# EAGLE design Particle Feather AdapterFeb2019v1 (EAGLE 9.3.0)
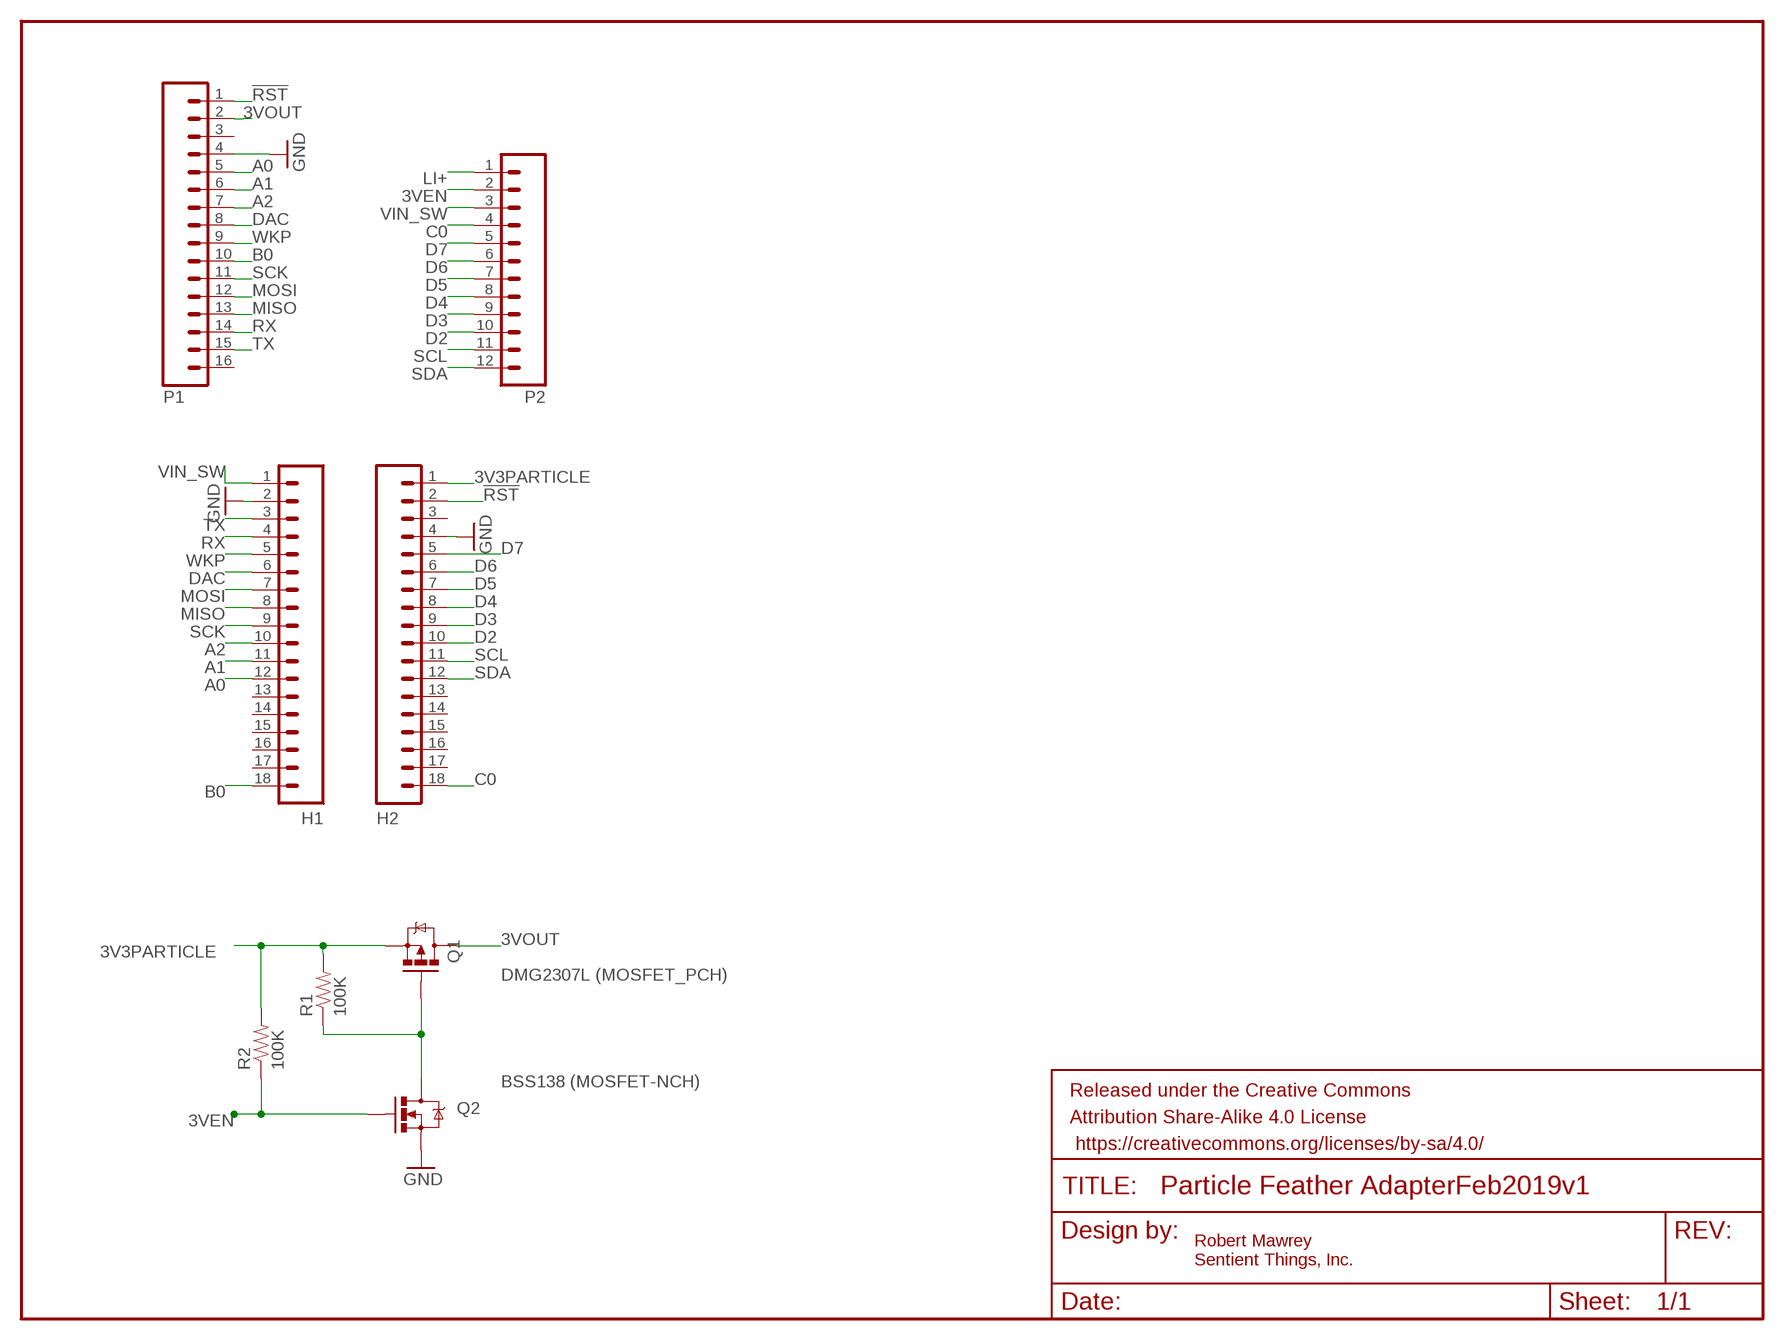
[diagram p0: schematic, sheet 1]

## Parts
FRAME1  FRAME-LETTER  [CREATIVE_COMMONS]
FRAME2  FRAME-LETTER  [CREATIVE_COMMONS]
H1  M18-MILLMAX  [1X18-01SMD]
H2  M18-MILLMAX  [1X18-01SMD]
P1  M16-FEATHER  [1X16-01SMDRIGHT]
P2  M12-FEATHER  [1X12-01SMDLEFT]
Q1  MOSFET-PCHANNELSMD  [SOT23-3]
Q2  MOSFET-NCHANNELSMD  [MAWREY_SOT23-3]
R1  100K  RESISTOR0603-RES  [0603-RES]
R2  100K  RESISTOR0603-RES  [0603-RES]

## Nets
3V3PARTICLE: H2.1 Q1.2(S) R1.2 R2.2
3VEN: P2.2 Q2.1(G) R2.1
3VOUT: P1.2 Q1.3(D)
!RST: H2.2 P1.1
A0: H1.12 P1.5
A1: H1.11 P1.6
A2: H1.10 P1.7
B0: H1.18 P1.10
C0: H2.18 P2.4
D2: H2.10 P2.10
D3: H2.9 P2.9
D4: H2.8 P2.8
D5: H2.7 P2.7
D6: H2.6 P2.6
D7: H2.5 P2.5
DAC: H1.6 P1.8
GND [power]: H1.2 H2.4 P1.4 Q2.2(S)
LI+: P2.1
MISO: H1.8 P1.13
MOSI: H1.7 P1.12
N$3: Q1.1(G) Q2.3(D) R1.1
RX: H1.4 P1.14
SCK: H1.9 P1.11
SCL: H2.11 P2.11
SDA: H2.12 P2.12
TX: H1.3 P1.15
VIN_SW [HighCurrent]: H1.1 P2.3
WKP: H1.5 P1.9
Unconnected: H1.13 H1.14 H1.15 H1.16 H1.17 H2.3 H2.13 H2.14 H2.15 H2.16 H2.17 P1.3 P1.16

## Notes on the sheet
- DMG2307L (MOSFET_PCH)
- BSS138 (MOSFET-NCH)
- Robert Mawrey
  Sentient Things, Inc.

## Library data of the parts
FRAME1 FRAME2 = Mawrey:FRAME-LETTER: Schematic Frame Standard 8.5x11 US Letter frame; PARTNO: DNP
H1 H2 = Mawrey:M18; PARTNO: 310-43-118-41-105000
P1 = Mawrey:M16; PARTNO: 68016-116HLF
P2 = Mawrey:M12: Header 12 Standard 12-pin 0.1" header. Use with straight break away headers (SKU : PRT-00116), right angle break away headers (PRT-00553), swiss pins (PRT-00743), machine pins (PRT-00117), and female headers (PRT-00115).; PARTNO: 68016-212HLF
Q1 = Mawrey:MOSFET-PCHANNEL; PARTNO: DMG2307L-7
Q2 = Mawrey:MOSFET-NCHANNEL; PARTNO: BSS138
R1 R2 = Mawrey:RESISTOR: Resistor Basic schematic elements and footprints for 0603, 1206, and PTH 1/10th watt (small) resistors.; PARTNO: RC0603JR-07100KL

## Net classes
0 default: width 0.254 mm, drill 0.508 mm, clearance 0.254 mm
1 power: width 0.508 mm, drill 0.508 mm, clearance 0.254 mm
2 HighCurrent: width 1.016 mm, drill 0.508 mm, clearance 0.178 mm

## Board
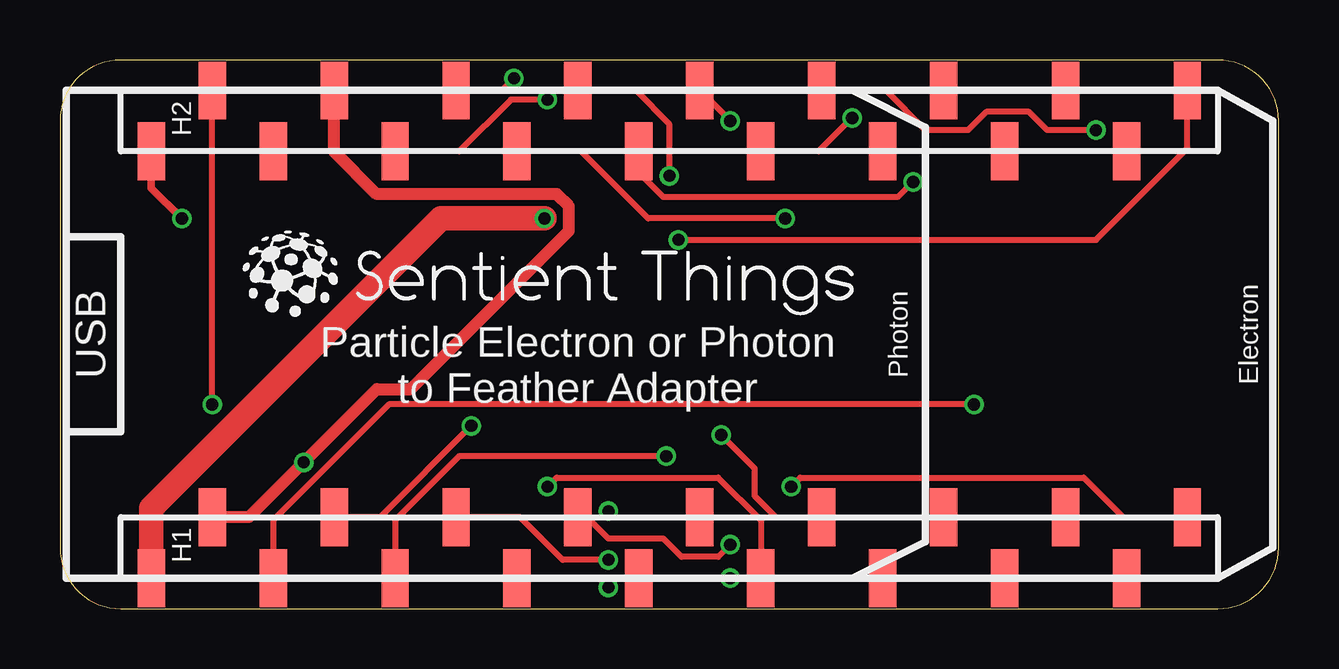
[diagram p1: board, top side]
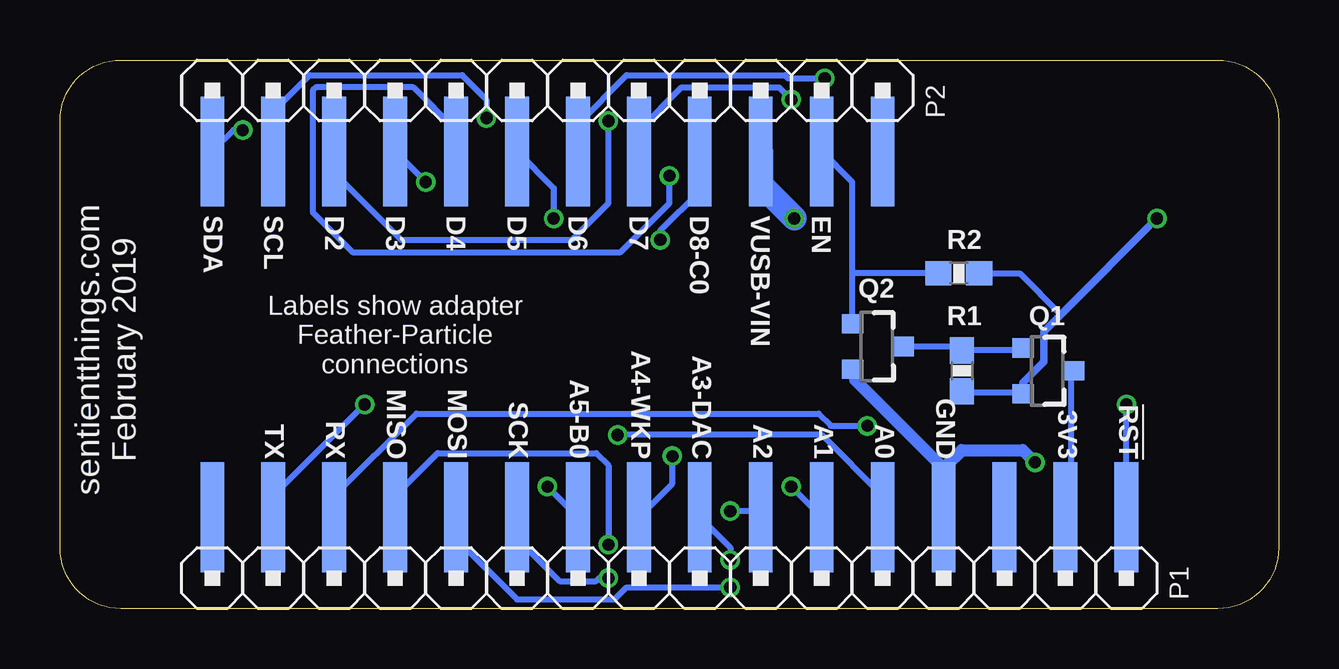
[diagram p2: board, bottom side, seen from below]

Size 50.8 x 22.86 mm. Coordinates in mm from the lower left corner, seen from the top.
Outline: 2.54,0 48.26,0 arc90 50.8,2.54 50.8,20.32 arc90 48.26,22.86 2.54,22.86 arc90 0,20.32 0,2.54 arc90 2.54,0
Copper layers (1*16): Top 0.035mm / dielectric 1.5mm / Bottom 0.035mm
Design rules "SeeedStudio_2layer_DRU_no_angle_20140221 *": minimum track width 6mil, minimum drill 20mil, track to track 6mil, track to pad 6mil, pad to pad 6mil, via to via 6mil, smd to smd 0mil, copper to edge 10mil, drill to drill 10mil, minimum pad ring 10mil, minimum via ring 6mil, stop-mask expansion 2mil, vias tented up to drill 100mil, thermal gap 10mil

### Footprints (pad centres in the part's own frame; a part is rotated, then mirrored left to right if it is on the bottom)
1X18-01SMD = smd 1.143 x 2.413: 1 0,0; 2 2.54,2.54; 3 5.08,0; 4 7.62,2.54; 5 10.16,0; 6 12.7,2.54; 7 15.24,0; 8 17.78,2.54; 9 20.32,0; 10 22.86,2.54; 11 25.4,0; 12 27.94,2.54; 13 30.48,0; 14 33.02,2.54; 15 35.56,0; 16 38.1,2.54; 17 40.64,0; 18 43.18,2.54
1X16-01SMDRIGHT = smd 0.991 x 4.572: 1 0,-2.54; 2 2.54,-2.54; 3 5.08,-2.54; 4 7.62,-2.54; 5 10.16,-2.54; 6 12.7,-2.54; 7 15.24,-2.54; 8 17.78,-2.54; 9 20.32,-2.54; 10 22.86,-2.54; 11 25.4,-2.54; 12 27.94,-2.54; 13 30.48,-2.54; 14 33.02,-2.54; 15 35.56,-2.54; 16 38.1,-2.54
1X12-01SMDLEFT = smd 0.991 x 4.572: 1 0,2.54; 2 2.54,2.54; 3 5.08,2.54; 4 7.62,2.54; 5 10.16,2.54; 6 12.7,2.54; 7 15.24,2.54; 8 17.78,2.54; 9 20.32,2.54; 10 22.86,2.54; 11 25.4,2.54; 12 27.94,2.54
SOT23-3 = smd 0.8 x 0.9: 1 -0.95,-1; 2 0.95,-1; 3 0,1.1
MAWREY_SOT23-3 = smd 0.8 x 0.9: 1 -0.95,-1; 2 0.95,-1; 3 0,1.1
0603-RES = smd 1.1 x 1: 1 -0.85,0; 2 0.85,0

### Placement (x,y rotation side)
FRAME1  21,-15 0 top  (outside the outline)
FRAME2  21,-24 0 top  (outside the outline)
H1  3.81,1.27 0 top
H2  3.81,19.05 0 top
P1  6.35,1.27 180 bottom
P2  16.51,21.59 180 bottom
Q1  9.65,9.91 270 bottom
Q2  16.76,10.92 270 bottom
R1  13.21,9.91 270 bottom
R2  13.34,13.97 0 bottom
U$1  [SENTIENT_THINGS]  7.62,12.06 0 top

### Tracks (layer width: path | path; a pad name or v marks a point on that pad's centre or on a via)
3V3PARTICLE  (via drill 0.51)
  Top 0.305: v5.08,16.26 3.81,17.53 H2.1
  Bottom 0.254: R1.2 13.21,9.02 10.67,9.02 Q1.2 10.67,9.14 10.67,9.4 | R2.2 10.79,13.97 9.08,12.26
  Bottom 0.305: v5.08,16.26 9.08,12.26 9.8,11.54 9.8,10.29 10.67,9.41 10.67,9.14
3VEN
  Bottom 0.254: 17.78,13.97 17.78,17.78 P2.2 | 17.78,13.97 17.78,11.94 Q2.1 | R2.1 17.78,13.97
3VOUT
  Bottom 0.254: P1.2 8.64,4.06 8.64,9.91 Q1.3
!RST  (via drill 0.51)
  Top 0.254: v6.35,8.51 H2.2
  Bottom 0.254: P1.1 v6.35,8.51
A0  (via drill 0.51)
  Top 0.254: H1.12 29.84,3.81 28.96,4.7 28.96,5.84 v27.56,7.24
  Bottom 0.254: P1.5 16.51,4.7 19.05,7.24 v27.56,7.24
A1  (via drill 0.51)
  Top 0.254: H1.11 29.21,3.68 27.43,5.46 20.7,5.46 v20.32,5.08
  Bottom 0.254: P1.6 v20.32,5.08
A2  (via drill 0.51)
  Top 0.254: H1.10 23.11,3.81 v22.86,4.06
  Bottom 0.254: v22.86,4.06 21.84,4.06 P1.7
B0  (via drill 0.51)
  Top 0.254: H1.18 44.32,3.81 42.67,5.46 30.86,5.46 v30.48,5.08
  Bottom 0.254: P1.10 v30.48,5.08
C0  (via drill 0.51)
  Top 0.254: H2.18 46.99,19.18 43.18,15.37 v25.78,15.37
  Bottom 0.254: v25.78,15.37 25.78,15.75 24.13,17.4 P2.4
D2  (via drill 0.51)
  Top 0.254: v27.94,20.32 H2.10
  Bottom 0.254: v27.94,20.32 27.94,16.89 29.46,15.37 36.58,15.37 39.37,18.16 P2.10
D3  (via drill 0.51)
  Top 0.254: H2.9 24.13,18.16 25.15,17.14 34.92,17.14 v35.56,17.78
  Bottom 0.254: P2.9 v35.56,17.78
D4  (via drill 0.51)
  Top 0.254: H2.8 24,21.59 25.4,20.19 v25.4,18.03
  Bottom 0.254: v25.4,18.03 25.4,16.89 27.43,14.86 38.61,14.86 40.26,16.51 40.26,21.59 40.13,21.72 36.07,21.72 34.29,19.94 P2.8
D5  (via drill 0.51)
  Top 0.254: H2.7 21.72,19.05 24.51,16.26 v30.23,16.26
  Bottom 0.254: v30.23,16.26 30.23,17.53 P2.7
D6  (via drill 0.51)
  Top 0.254: H2.6 18.41,21.59 v18.92,22.1
  Bottom 0.254: v18.92,22.1 20.45,22.1 20.57,22.23 27.18,22.23 29.21,20.19 P2.6
D7  (via drill 0.51)
  Top 0.254: H2.5 16.64,19.05 18.8,21.21 v20.32,21.21
  Bottom 0.254: v20.32,21.21 20.83,21.72 24.89,21.72 26.67,19.94 P2.5
DAC  (via drill 0.51)
  Top 0.254: H1.6 19.18,3.81 20.95,2.03 v22.86,2.03
  Bottom 0.254: v22.86,2.03 22.86,2.54 P1.8
GND  (via drill 0.51)
  Top 0.508: H1.2 7.87,3.81 v10.16,6.1 10.29,6.22 13.21,9.14 14.61,9.14 21.21,15.75 21.21,16.76 20.7,17.27 13.21,17.27 11.43,19.05 H2.4
  Bottom 0.508: Q2.2 17.65,9.91 17.65,9.53 13.97,5.84 P1.4 13.84,5.97 13.21,6.6 10.67,6.6 v10.16,6.1
MISO  (via drill 0.51)
  Top 0.254: H1.8 21.97,3.81 22.86,2.92 25.15,2.92 25.91,2.16 27.43,2.16 v27.94,2.67
  Bottom 0.254: v27.94,2.67 27.94,5.97 28.45,6.48 35.05,6.48 36.83,4.7 P1.13
MOSI  (via drill 0.51)
  Top 0.254: H1.7 22.48,1.27 v22.86,0.89
  Bottom 0.254: v22.86,0.89 27.18,0.89 27.69,0.38 31.75,0.38 34.29,2.92 P1.12
N$3
  Bottom 0.254: 13.21,10.79 10.67,10.79 Q1.1 | 13.21,10.79 R1.1 13.21,10.79 | 13.21,10.79 13.34,10.92 15.62,10.92 Q2.3
RX  (via drill 0.51)
  Top 0.254: H1.4 13.34,3.81 v17.14,7.62
  Bottom 0.254: v17.14,7.62 18.67,7.62 19.18,8.13 35.94,8.13 39.37,4.7 P1.14
SCK  (via drill 0.51)
  Top 0.254: v27.94,1.27 H1.9
  Bottom 0.254: v27.94,1.27 28.32,1.27 28.45,1.14 29.97,1.14 31.75,2.92 P1.11
SCL  (via drill 0.51)
  Top 0.254: H2.11 31.62,19.05 v33.02,20.45
  Bottom 0.254: v33.02,20.45 33.02,21.21 34.04,22.23 40.39,22.23 41.91,20.7 P2.11
SDA  (via drill 0.51)
  Top 0.254: H2.12 34.42,21.59 36.07,19.94 37.85,19.94 38.61,20.7 40.39,20.7 41.15,19.94 v43.18,19.94
  Bottom 0.254: v43.18,19.94 43.56,19.94 P2.12
TX  (via drill 0.51)
  Top 0.254: H1.3 8.89,3.68 13.72,8.51 v38.1,8.51
  Bottom 0.254: v38.1,8.51 41.91,4.7 P1.15
VIN_SW  (via drill 0.51)
  Top 1.016: H1.1 3.81,4.19 15.88,16.26 v20.19,16.26
  Bottom 1.016: v20.19,16.26 21.59,17.65 P2.3
WKP  (via drill 0.51)
  Top 0.254: H1.5 13.97,3.68 16.64,6.35 v25.27,6.35
  Bottom 0.254: v25.27,6.35 25.27,5.21 P1.9

### Text on the board
tPlace: USB | Photon | Electron | Particle Electron or Photon / to Feather Adapter
bPlace: EN / VUSB-VIN / D8-C0 / D7 / D6 / D5 / D4 / D3 / D2 / SCL / SDA | Labels show adapter / Feather-Particle / connections | sentientthings.com / February 2019 | !RST / 3V3 / / GND / A0 / A1 / A2 / A3-DAC / A4-WKP / A5-B0 / SCK / MOSI / MISO / RX / TX
Measures: 58.4 x 57.7 mm
_tsilk: VinSW / GND / TX0 / RX0 / WAKE / / MOSI / MISO / SCK / A4 / A3 / A2 / A1 / A0 | Electron | Photon | 3V3 / !RST / / GND / GIOF / GIOE / GIOD / GIOC / GIOB / GIOA / SCL0 / SDA0 / CANRX / CANTX / TX1 / RX1 | Particle / Adapter | Aug 2018